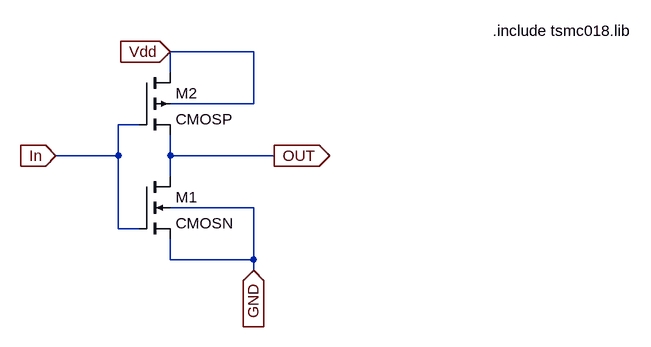
[diagram p0: schematic INVERTER_Gate.asc]
INVERTER_Gate.asc, the LTspice schematic file:
Version 4
SHEET 1 1204 680
WIRE 576 -240 448 -240
WIRE 448 -208 448 -240
WIRE 576 -160 576 -240
WIRE 576 -160 448 -160
WIRE 400 -128 368 -128
WIRE 368 -80 368 -128
WIRE 368 -80 272 -80
WIRE 448 -80 448 -112
WIRE 608 -80 448 -80
WIRE 448 -48 448 -80
WIRE 576 0 448 0
WIRE 368 32 368 -80
WIRE 400 32 368 32
WIRE 448 80 448 48
WIRE 576 80 576 0
WIRE 576 80 448 80
WIRE 576 96 576 80
FLAG 448 -240 Vdd
IOPIN 448 -240 In
FLAG 272 -80 In
IOPIN 272 -80 In
FLAG 608 -80 OUT
IOPIN 608 -80 Out
FLAG 576 96 GND
IOPIN 576 96 In
SYMBOL cmosn 400 -48 R0
SYMATTR InstName M1
SYMBOL cmosp 400 -208 R0
SYMATTR InstName M2
TEXT 944 -272 Left 2 !.include tsmc018.lib

The netlist it stands for:
* INVERTER_Gate.asc
M1 OUT In GND GND CMOSN
M2 Vdd In OUT Vdd CMOSP
.model NMOS NMOS
.model PMOS PMOS
.lib standard.mos
.include tsmc018.lib
.backanno
.end